# Altium schematic sheet Mechanical.SchDoc: NER A Size Template
size Tabloid; ApprovedBy: WS; DrawnBy: Cameron Gordon & Elise Cooke; Address4: X.X.X; Revision: 1; SheetNumber: 4; SheetTotal: 4
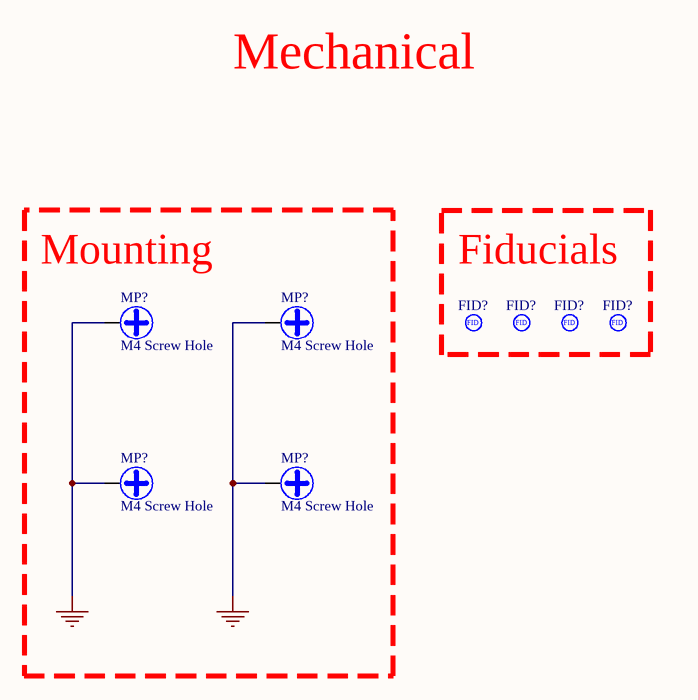
[diagram p0: Mechanical.SchDoc]

## Parts
(Parts that share a designator on the sheet are numbered #1, #2 ... from top to bottom, then left to right.)
FID?#1  Fiducial  [40 mil Circular Test Point]  (value not drawn)
FID?#2  Fiducial  [40 mil Circular Test Point]  (value not drawn)
FID?#3  Fiducial  [40 mil Circular Test Point]  (value not drawn)
FID?#4  Fiducial  [40 mil Circular Test Point]  (value not drawn)
MP?#1  M4 Screw Hole  [New footprint 1]
MP?#2  M4 Screw Hole  [New footprint 1]
MP?#3  M4 Screw Hole  [New footprint 1]
MP?#4  M4 Screw Hole  [New footprint 1]

## Blocks framed on the sheet
Mounting: MP?#1-MP?#4
Fiducials: FID?#1-FID?#4

## Nets
GND: MP?#1.1 MP?#2.1 MP?#3.1 MP?#4.1

## Notes on the sheet
- Mechanical
- Project Name:
- Drawer:
- Variant:
- Revision:
- Date:
- Page:
- of
- Capstone 2023
- (in symbol CMP-00019-1) FID

## Library data of the parts
FID?#1-FID?#4 = CMP-00019-1
MP?#1-MP?#4 = CMP-00024-1: Plated hole for M4 mounting hardware